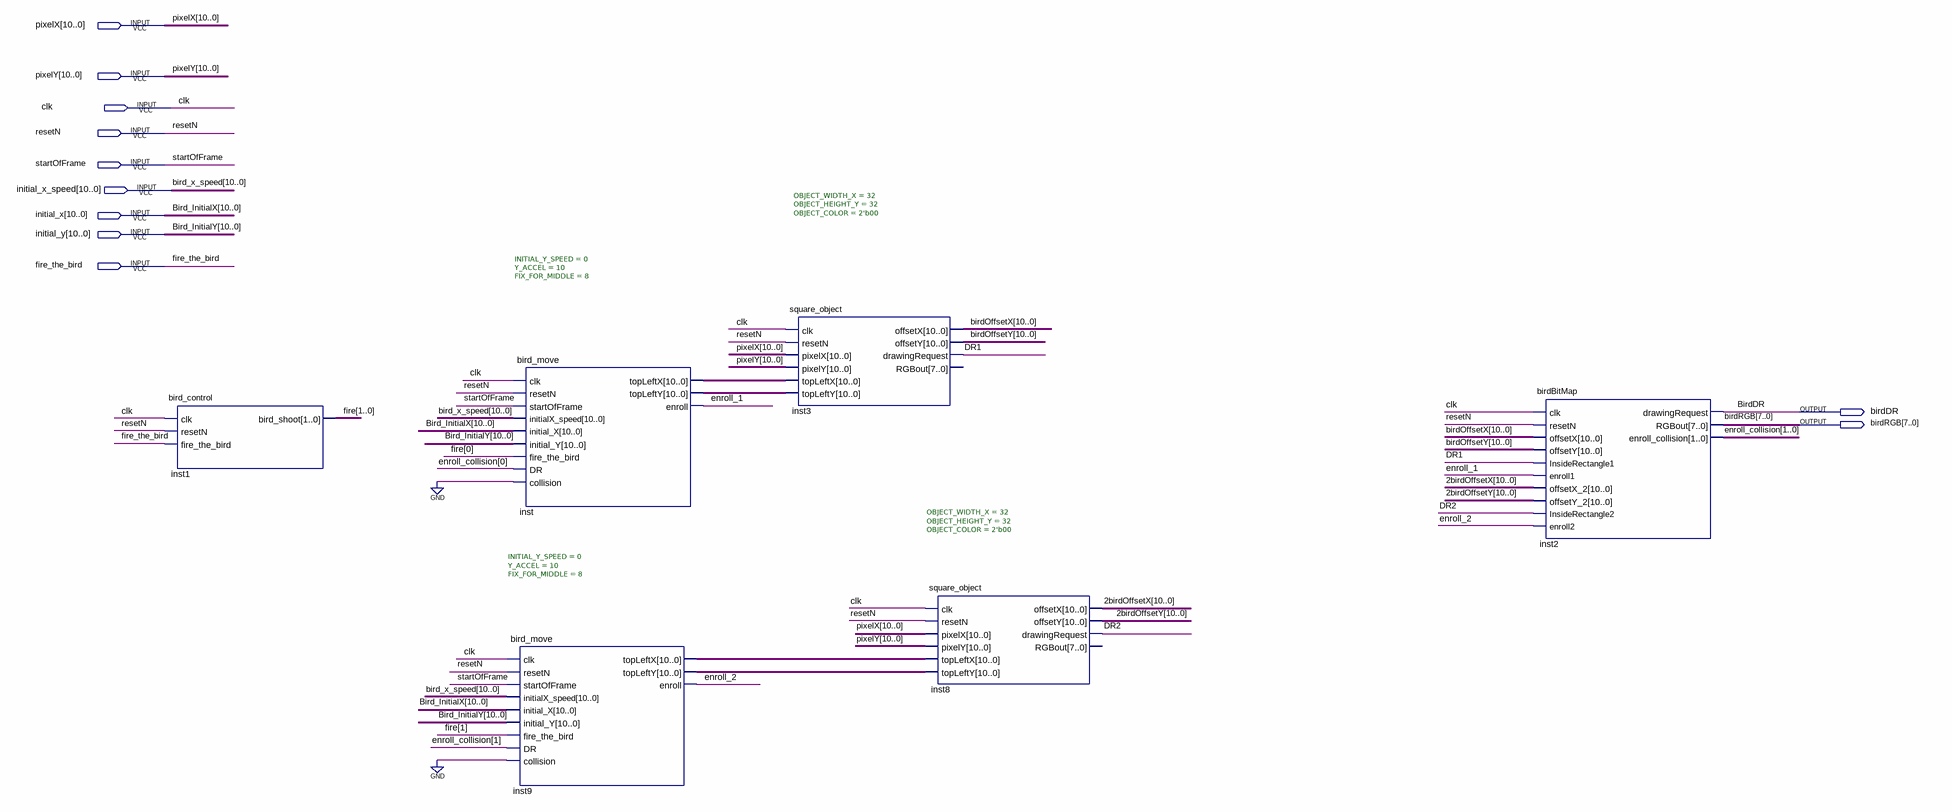
[diagram p0: schematic sheet]
// Quartus schematic Bird_Block_T.bdf as structural Verilog: 6 symbols, 11 pins
module Bird_Block_T (
  input  [10:0] pixelX,
  input  [10:0] pixelY,
  input  clk,
  input  resetN,
  input  startOfFrame,
  input  [10:0] initial_x_speed,
  input  [10:0] initial_x,
  input  [10:0] initial_y,
  input  fire_the_bird,
  output birdDR,
  output [7:0] birdRGB
);

  wire DR1, DR2, enroll_1, enroll_2;
  wire [1:0] enroll_collision, fire;
  wire [10:0] \2birdOffsetX , \2birdOffsetY , birdOffsetX, birdOffsetY, inst9_topleftx, inst9_toplefty,
       inst_topleftx, inst_toplefty;

  bird_control inst1 (.clk(clk), .resetN(resetN), .fire_the_bird(fire_the_bird), .bird_shoot(fire));
  bird_move #(.INITIAL_Y_SPEED(0), .Y_ACCEL(10), .FIX_FOR_MIDDLE(8)) inst (
    .clk(clk), .resetN(resetN), .startOfFrame(startOfFrame), .initialX_speed(initial_x_speed),
    .initial_X(initial_x), .initial_Y(initial_y), .fire_the_bird(fire[0]), .DR(enroll_collision[0]),
    .collision(1'b0), .topLeftX(inst_topleftx), .topLeftY(inst_toplefty), .enroll(enroll_1));
  bird_move #(.INITIAL_Y_SPEED(0), .Y_ACCEL(10), .FIX_FOR_MIDDLE(8)) inst9 (
    .clk(clk), .resetN(resetN), .startOfFrame(startOfFrame), .initialX_speed(initial_x_speed),
    .initial_X(initial_x), .initial_Y(initial_y), .fire_the_bird(fire[1]), .DR(enroll_collision[1]),
    .collision(1'b0), .topLeftX(inst9_topleftx), .topLeftY(inst9_toplefty), .enroll(enroll_2));
  square_object #(.OBJECT_WIDTH_X(32), .OBJECT_HEIGHT_Y(32), .OBJECT_COLOR(2'b00)) inst3 (
    .clk(clk), .resetN(resetN), .pixelX(pixelX), .pixelY(pixelY), .topLeftX(inst_topleftx),
    .topLeftY(inst_toplefty), .offsetX(birdOffsetX), .offsetY(birdOffsetY), .drawingRequest(DR1));  // open: RGBout
  square_object #(.OBJECT_WIDTH_X(32), .OBJECT_HEIGHT_Y(32), .OBJECT_COLOR(2'b00)) inst8 (
    .clk(clk), .resetN(resetN), .pixelX(pixelX), .pixelY(pixelY), .topLeftX(inst9_topleftx),
    .topLeftY(inst9_toplefty), .offsetX(\2birdOffsetX ), .offsetY(\2birdOffsetY ), .drawingRequest(DR2));  // open: RGBout
  birdBitMap inst2 (
    .clk(clk), .resetN(resetN), .offsetX(birdOffsetX), .offsetY(birdOffsetY), .InsideRectangle1(DR1),
    .enroll1(enroll_1), .offsetX_2(\2birdOffsetX ), .offsetY_2(\2birdOffsetY ), .InsideRectangle2(DR2),
    .enroll2(enroll_2), .drawingRequest(birdDR), .RGBout(birdRGB), .enroll_collision(enroll_collision));

  // Other names for the same wires on the sheet: Bird_InitialX[10:0] = initial_x; Bird_InitialY[10:0] = initial_y;
  //   bird_x_speed[10:0] = initial_x_speed
endmodule
